# Altium project stove.PrjPcb
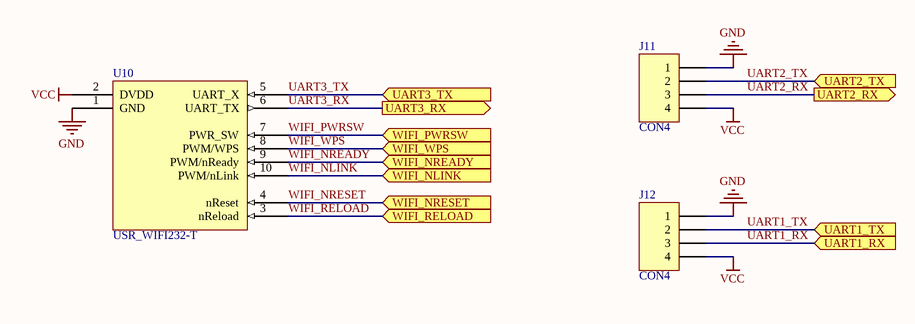
[diagram p0: misc.SchDoc]
6 sheets, 119 parts. Net scope: hierarchical (ports join the sheet entries above them; power ports are global).
Sheets:
  misc.SchDoc
  main.SchDoc
    U_sensor = sensor.SchDoc
    U_power = power.SchDoc
    U_relay_scr = relay_scr.SchDoc
    U_reset = reset.SchDoc

## Sheet misc.SchDoc
size A4

### Parts
J11  CON4  [HDR1X4]
J12  CON4  [HDR1X4]
U10  USR_WIFI232-T

### Ports
UART1_RX (in), UART1_TX (in), UART2_RX (out), UART2_TX (in), UART3_RX (out), UART3_TX (in), WIFI_NLINK (in), WIFI_NREADY (in), WIFI_NRESET (in), WIFI_PWRSW (in), WIFI_RELOAD (in), WIFI_WPS (in)

### Nets
GND: J11.1 J12.1 U10.1(GND)
VCC: J11.4 J12.4 U10.2(DVDD)
UART1_RX: J12.3 ; port UART1_RX
UART1_TX: J12.2 ; port UART1_TX
UART2_RX: J11.3 ; port UART2_RX
UART2_TX: J11.2 ; port UART2_TX
UART3_RX: U10.6(UART_TX) ; port UART3_RX
UART3_TX: U10.5(UART_X) ; port UART3_TX
WIFI_NLINK: U10.10(PWM/nLink) ; port WIFI_NLINK
WIFI_NREADY: U10.9(PWM/nReady) ; port WIFI_NREADY
WIFI_NRESET: U10.4(nReset) ; port WIFI_NRESET
WIFI_PWRSW: U10.7(PWR_SW) ; port WIFI_PWRSW
WIFI_RELOAD: U10.3(nReload) ; port WIFI_RELOAD
WIFI_WPS: U10.8(PWM/WPS) ; port WIFI_WPS

### Library data of the parts
J11 J12 = Header 4: Header, 4-Pin; LatestRevisionDate: 17-Jul-2002; LatestRevisionNote: Re-released for DXP Platform.; Publisher: Altium Limited

## Sheet main.SchDoc
size A4
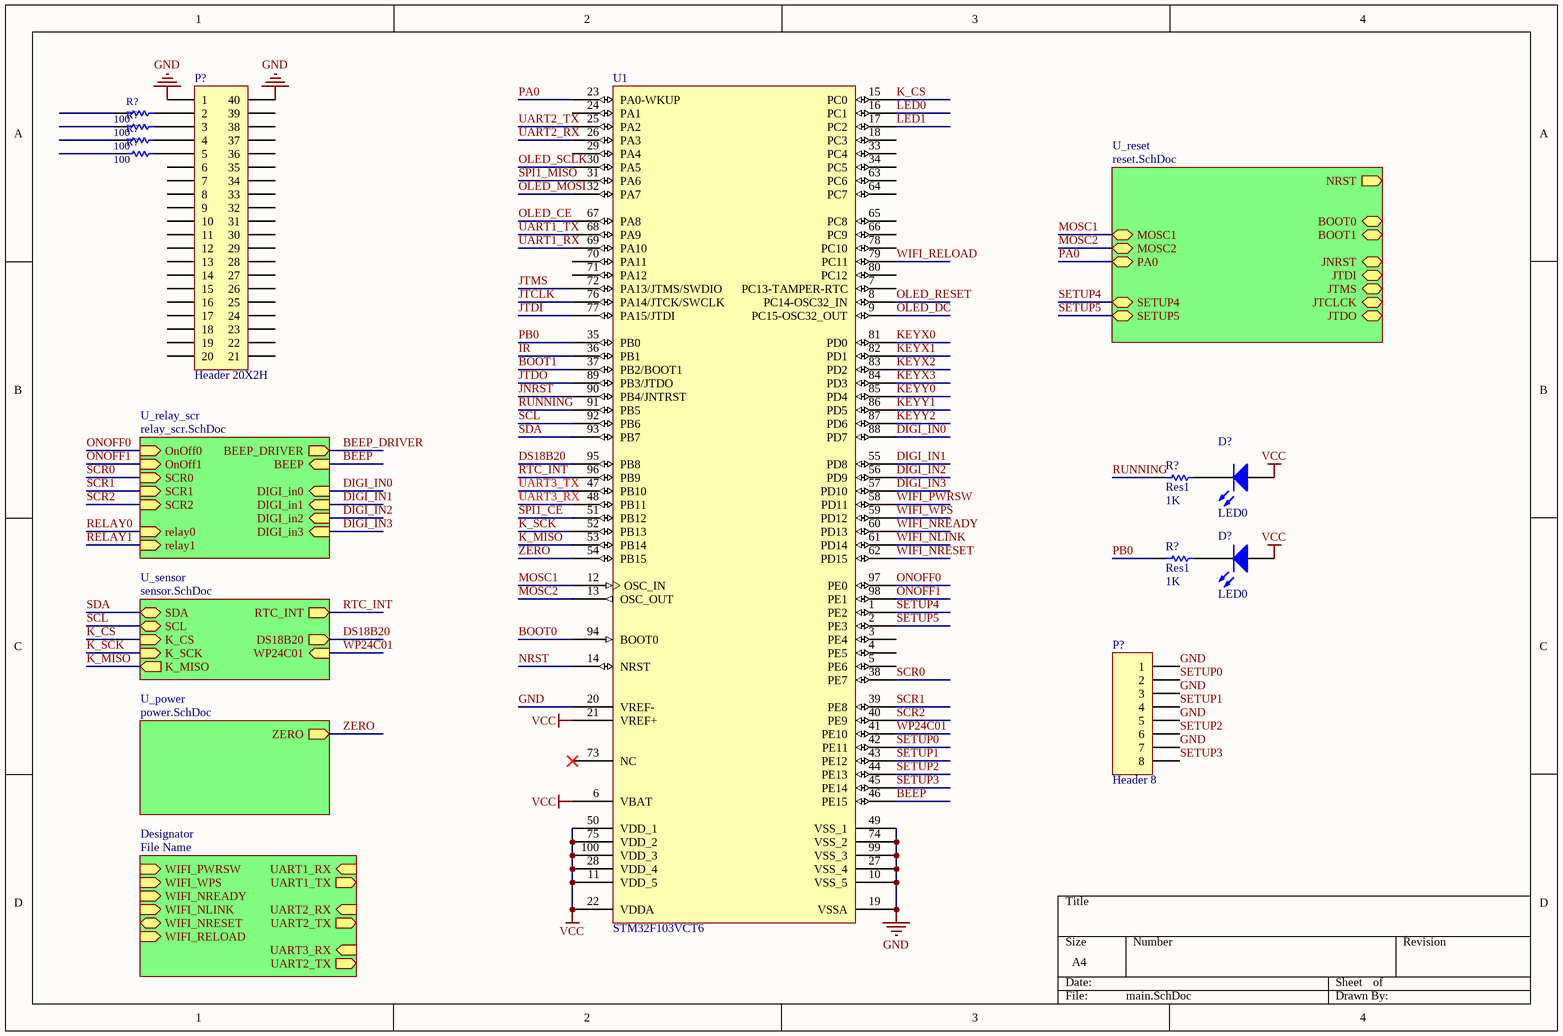
[diagram p1: main.SchDoc]

### Parts
(Parts that share a designator on the sheet are numbered #1, #2 ... from top to bottom, then left to right.)
D?#1  LED0  [LED-0]
D?#2  LED0  [LED-0]
P?#1  Header 20X2H  [HDR2X20H]
P?#2  Header 8  [HDR1X8]
R?#1  value 100  [AXIAL-0.3]  (hidden comment: Res1)
R?#2  value 100  [AXIAL-0.3]  (hidden comment: Res1)
R?#3  value 100  [AXIAL-0.3]  (hidden comment: Res1)
R?#4  value 100  [AXIAL-0.3]  (hidden comment: Res1)
R?#5  Res1  value 1K  [AXIAL-0.3]
R?#6  Res1  value 1K  [AXIAL-0.3]
U1  STM32F103VCT6  [LQFP100_N]

### Sub-sheets
Designator = File Name (file not in this document): WIFI_PWRSW (in), WIFI_WPS (in), WIFI_NREADY (in), WIFI_NLINK (in), WIFI_NRESET, WIFI_RELOAD (in), UART1_RX (in), UART1_TX (out), UART2_RX (in), UART2_TX (out), UART3_RX (in), UART2_TX (out)
U_power = power.SchDoc: ZERO (out)
U_relay_scr = relay_scr.SchDoc: OnOff0 (in), OnOff1 (in), SCR0 (in), SCR1 (in), SCR2 (in), relay0 (in), relay1 (in), BEEP_DRIVER (out), BEEP (in), DIGI_in0 (in), DIGI_in1 (in), DIGI_in2 (in), DIGI_in3 (in)
U_reset = reset.SchDoc: NRST (out), BOOT0, BOOT1, JNRST, JTDI, JTMS, JTCLCK, JTDO, MOSC1, MOSC2, PA0, SETUP4, SETUP5
U_sensor = sensor.SchDoc: SDA, SCL, K_CS (in), K_SCK (in), K_MISO (out), RTC_INT (out), DS18B20 (out), WP24C01 (in)

### Nets
GND: P?#1.1 P?#1.40 P?#2.1 P?#2.3 P?#2.5 P?#2.7 U1.10(VSS_5) U1.19(VSSA) U1.20(VREF-) U1.27(VSS_4) U1.49(VSS_1) U1.74(VSS_2) U1.99(VSS_3)
VCC: D?#1.1(A) D?#2.1(A) U1.6(VBAT) U1.11(VDD_5) U1.21(VREF+) U1.22(VDDA) U1.28(VDD_4) U1.50(VDD_1) U1.75(VDD_2) U1.100(VDD_3)
BEEP: U1.46(PE15) ; sheet U_relay_scr/BEEP
BOOT0: U1.94(BOOT0)
BOOT1: U1.37(PB2/BOOT1)
DIGI_IN0: U1.88(PD7) ; sheet U_relay_scr/DIGI_in0
DIGI_IN1: U1.55(PD8) ; sheet U_relay_scr/DIGI_in1
DIGI_IN2: U1.56(PD9) ; sheet U_relay_scr/DIGI_in2
DIGI_IN3: U1.57(PD10) ; sheet U_relay_scr/DIGI_in3
DS18B20: U1.95(PB8) ; sheet U_sensor/DS18B20
IR: U1.36(PB1)
JNRST: U1.90(PB4/JNTRST)
JTCLK: U1.76(PA14/JTCK/SWCLK)
JTDI: U1.77(PA15/JTDI)
JTDO: U1.89(PB3/JTDO)
JTMS: U1.72(PA13/JTMS/SWDIO)
K_CS: U1.15(PC0) ; sheet U_sensor/K_CS
K_MISO: U1.53(PB14) ; sheet U_sensor/K_MISO
K_SCK: U1.52(PB13) ; sheet U_sensor/K_SCK
KEYX0: U1.81(PD0)
KEYX1: U1.82(PD1)
KEYX2: U1.83(PD2)
KEYX3: U1.84(PD3)
KEYY0: U1.85(PD4)
KEYY1: U1.86(PD5)
KEYY2: U1.87(PD6)
LED0: U1.16(PC1)
LED1: U1.17(PC2)
MOSC1: U1.12(OSC_IN) ; sheet U_reset/MOSC1
MOSC2: U1.13(OSC_OUT) ; sheet U_reset/MOSC2
NRST: U1.14(NRST)
OLED_CE: U1.67(PA8)
OLED_DC: U1.9(PC15-OSC32_OUT)
OLED_MOSI: U1.32(PA7)
OLED_RESET: U1.8(PC14-OSC32_IN)
OLED_SCLK: U1.30(PA5)
ONOFF0: U1.97(PE0) ; sheet U_relay_scr/OnOff0
ONOFF1: U1.98(PE1) ; sheet U_relay_scr/OnOff1
PA0: U1.23(PA0-WKUP) ; sheet U_reset/PA0
PB0: R?#6.1 U1.35(PB0)
RTC_INT: U1.96(PB9) ; sheet U_sensor/RTC_INT
RUNNING: R?#5.1 U1.91(PB5)
SCL: U1.92(PB6) ; sheet U_sensor/SCL
SCR0: U1.38(PE7) ; sheet U_relay_scr/SCR0
SCR1: U1.39(PE8) ; sheet U_relay_scr/SCR1
SCR2: U1.40(PE9) ; sheet U_relay_scr/SCR2
SDA: U1.93(PB7) ; sheet U_sensor/SDA
SETUP0: P?#2.2 U1.42(PE11)
SETUP1: P?#2.4 U1.43(PE12)
SETUP2: P?#2.6 U1.44(PE13)
SETUP3: P?#2.8 U1.45(PE14)
SETUP4: U1.1(PE2) ; sheet U_reset/SETUP4
SETUP5: U1.2(PE3) ; sheet U_reset/SETUP5
SPI1_CE: U1.51(PB12)
SPI1_MISO: U1.31(PA6)
UART1_RX: U1.69(PA10)
UART1_TX: U1.68(PA9)
UART2_RX: U1.26(PA3)
UART2_TX: U1.25(PA2)
UART3_RX: U1.48(PB11)
UART3_TX: U1.47(PB10)
WIFI_NLINK: U1.61(PD14)
WIFI_NREADY: U1.60(PD13)
WIFI_NRESET: U1.62(PD15)
WIFI_PWRSW: U1.58(PD11)
WIFI_RELOAD: U1.79(PC11)
WIFI_WPS: U1.59(PD12)
WP24C01: U1.41(PE10) ; sheet U_sensor/WP24C01
ZERO: U1.54(PB15) ; sheet U_power/ZERO
NetD?#1_2: D?#1.2(K) R?#5.2
NetD?#2_2: D?#2.2(K) R?#6.2
NetP?#1_2: P?#1.2 R?#1.2
NetP?#1_3: P?#1.3 R?#2.2
NetP?#1_4: P?#1.4 R?#3.2
NetP?#1_5: P?#1.5 R?#4.2

Not connected (* = marked no-connect by the designer): P?#1 6 7 8 9 10 11 12 13 14 15 16 17 18 19 20 21 22 23 24 25 26 27 28 29 30 31 32 33 34 35 36 37 38 39; R?#1 1; R?#2 1; R?#3 1; R?#4 1; U1 3(PE4) 4(PE5) 5(PE6) 7(PC13-TAMPER-RTC) 18(PC3) 24(PA1) 29(PA4) 33(PC4) 34(PC5) 63(PC6) 64(PC7) 65(PC8) 66(PC9) 70(PA11) 71(PA12) 73(NC)* 78(PC10) 80(PC12)

### Library data of the parts
D?#1 D?#2 = LED0: Typical INFRARED GaAs LED; Published: 8-Jun-2000; LatestRevisionDate: 08-Jul-2005; LatestRevisionNote: Mech Layer 1 removed.; PackageReference: LED-0; Publisher: Altium Limited; PackageDescription: LED; 2 Leads
P?#1 = Header 20X2H: Header, 20-Pin, Dual row, Right Angle; LatestRevisionDate: 17-Jul-2002; LatestRevisionNote: Re-released for DXP Platform.; Publisher: Altium Limited
P?#2 = Header 8: Header, 8-Pin; LatestRevisionDate: 17-Jul-2002; LatestRevisionNote: Re-released for DXP Platform.; Publisher: Altium Limited
R?#1-R?#6 = Res1: Resistor; Published: 8-Jun-2000; LatestRevisionDate: 17-Jul-2002; LatestRevisionNote: Re-released for DXP Platform.; PackageReference: AXIAL-0.3; Publisher: Altium Limited; PackageDescription: Axial Device, Thru-Hole; 2 Leads; 0.3 in Pin Spacing
U1 = STM32F103VBT6: STM32 ARM-based 32-bit MCU with 64 Kbytes Flash, 100-pin LQFP, Industrial Temperature; Published: 30-May-2008; DatasheetVersion: rev6, Mar-2008; PackageVersion: Mar-2008; PackageReference: LQFP100; Publisher: Altium Limited; PackageDescription: 100-Pin Low-Profile Quad Flat Pack, 14 x 14 mm Body, 0.5 mm Pitch (LQFP100); ComponentLink1Description: Manufacturer Link; ComponentLink1URL: www.st.com/stm32; ComponentLink2Description: Datasheet; ComponentLink2URL: http://www.st.com/stonline/products/literature/ds/13587.pdf

## Sheet sensor.SchDoc
size A4
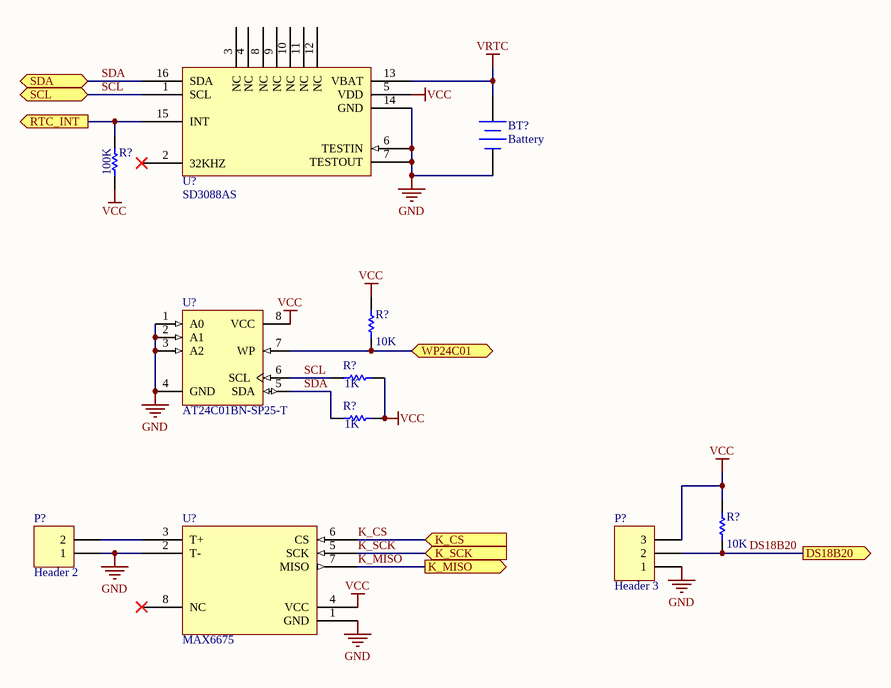
[diagram p2: sensor.SchDoc]

### Parts
(Parts that share a designator on the sheet are numbered #1, #2 ... from top to bottom, then left to right.)
BT?  Battery  [BAT-2]
P?#3  Header 2  [HDR1X2]
P?#4  Header 3  [HDR1X3]
R?#7  value 100K  [AXIAL-0.3]  (hidden comment: Res1)
R?#8  value 10K  [AXIAL-0.3]  (hidden comment: Res1)
R?#9  value 1K  [AXIAL-0.3]  (hidden comment: Res1)
R?#10  value 1K  [AXIAL-0.3]  (hidden comment: Res1)
R?#11  value 10K  [AXIAL-0.3]  (hidden comment: Res1)
U?#1  SD3088AS
U?#2  AT24C01BN-SP25-T  [8S1_N]
U?#3  MAX6675

### Ports
DS18B20 (out), K_CS (in), K_MISO (out), K_SCK (in), RTC_INT (out), SCL (bidir), SDA (bidir), WP24C01

### Nets
GND: BT?.2(-) P?#3.1 P?#4.1 U?#1.6(TESTIN) U?#1.7(TESTOUT) U?#1.14(GND) U?#2.1(A0) U?#2.2(A1) U?#2.3(A2) U?#2.4(GND) U?#3.1(GND) U?#3.2(T-)
VCC: P?#4.3 R?#7.1 R?#8.2 R?#9.2 R?#10.2 R?#11.2 U?#1.5(VDD) U?#2.8(VCC) U?#3.4(VCC)
VRTC: BT?.1(+) U?#1.13(VBAT)
DS18B20: P?#4.2 R?#11.1 ; port DS18B20
K_CS: U?#3.6(CS) ; port K_CS
K_MISO: U?#3.7(MISO) ; port K_MISO
K_SCK: U?#3.5(SCK) ; port K_SCK
RTC_INT: R?#7.2 U?#1.15(INT) ; port RTC_INT
SCL: R?#9.1 U?#1.1(SCL) U?#2.6(SCL) ; port SCL
SDA: R?#10.1 U?#1.16(SDA) U?#2.5(SDA) ; port SDA
WP24C01: R?#8.1 U?#2.7(WP) ; port WP24C01
NetP?#3_2: P?#3.2 U?#3.3(T+)

Not connected (* = marked no-connect by the designer): U?#1 2(32KHZ)* 3(NC) 4(NC) 8(NC) 9(NC) 10(NC) 11(NC) 12(NC); U?#3 8(NC)*

### Library data of the parts
BT? = Battery: Multicell Battery; Published: 24-Mar-1999; LatestRevisionDate: 17-Jul-2002; LatestRevisionNote: Re-released for DXP Platform.; PackageReference: BAT-2; Publisher: Altium Limited; PackageDescription: Battery; 2 Leads
P?#3 = Header 2: Header, 2-Pin; LatestRevisionDate: 17-Jul-2002; LatestRevisionNote: Re-released for DXP Platform.; Publisher: Altium Limited
P?#4 = Header 3: Header, 3-Pin; LatestRevisionDate: 17-Jul-2002; LatestRevisionNote: Re-released for DXP Platform.; Publisher: Altium Limited
R?#7-R?#11 = Res1: Resistor; Published: 8-Jun-2000; LatestRevisionDate: 17-Jul-2002; LatestRevisionNote: Re-released for DXP Platform.; PackageReference: AXIAL-0.3; Publisher: Altium Limited; PackageDescription: Axial Device, Thru-Hole; 2 Leads; 0.3 in Pin Spacing
U?#2 = AT24C01BN-SP25-T: 1Kbit (128 x 8), 2-wire Bus Automotive Serial EEPROM with Write Protect, 2.5V, 8-Pin SOIC, Tape & Reel; Published: 20-Sep-2010; DatasheetVersion: 8517C,  Jan-2009; PackageVersion: revC, Mar-2005; PackageReference: 8S1; Publisher: Altium Limited; PackageDescription: 8-Lead (0.150" Wide Body), Plastic Gull Wing Small Outline (JEDEC SOIC); Code_JEDEC: MS-012-AA; Code_IPC: SOIC127P600-8; ComponentLink1Description: Manufacturer Link; ComponentLink1URL: http://www.atmel.com/products/serial/default.asp; ComponentLink2Description: Datasheet; ComponentLink2URL: http://www.atmel.com/dyn/resources/prod_documents/doc8517.pdf; ComponentLink3Description: Atmel.com Home; ComponentLink3URL: http://www.atmel.com

## Sheet power.SchDoc
size A4
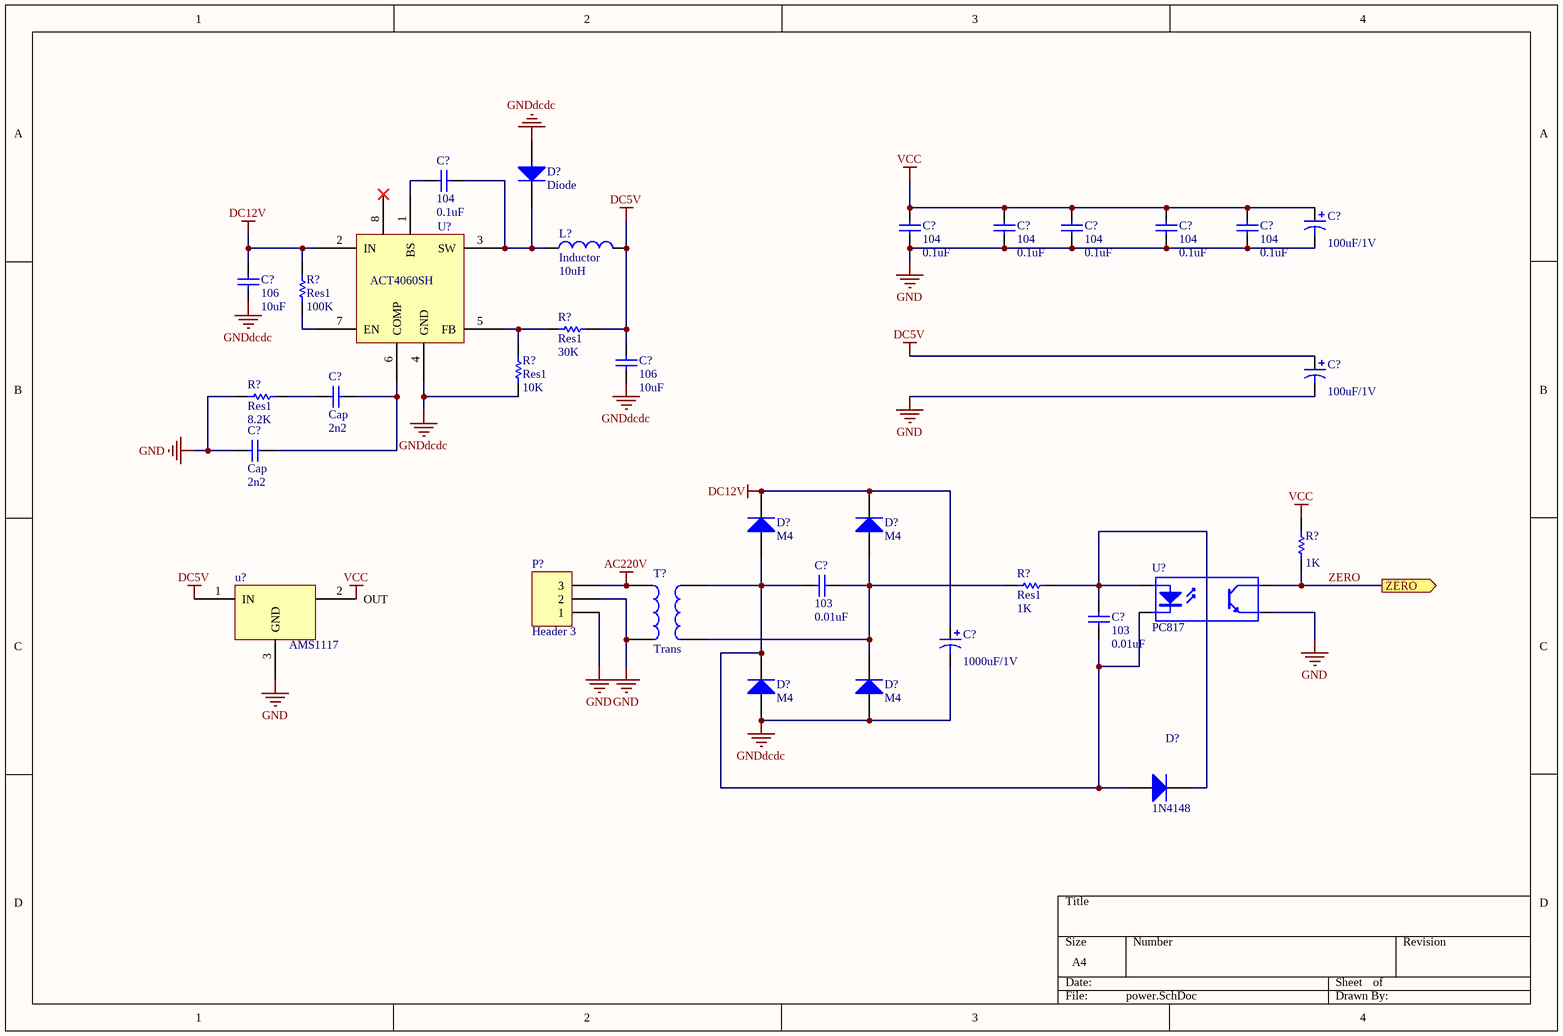
[diagram p3: power.SchDoc]

### Parts
(Parts that share a designator on the sheet are numbered #1, #2 ... from top to bottom, then left to right.)
C?#1  104  value 0.1uF  [RAD-0.3]
C?#2  value 100uF/1V  [RB7.6-15]  (hidden comment: Cap Pol1)
C?#3  104  value 0.1uF  [RAD-0.3]
C?#4  104  value 0.1uF  [RAD-0.3]
C?#5  104  value 0.1uF  [RAD-0.3]
C?#6  104  value 0.1uF  [RAD-0.3]
C?#7  104  value 0.1uF  [RAD-0.3]
C?#8  106  value 10uF  [RAD-0.3]
C?#9  106  value 10uF  [RAD-0.3]
C?#10  value 100uF/1V  [RB7.6-15]  (hidden comment: Cap Pol1)
C?#11  Cap  value 2n2  [RAD-0.3]
C?#12  Cap  value 2n2  [RAD-0.3]
C?#13  103  value 0.01uF  [RAD-0.3]
C?#14  103  value 0.01uF  [RAD-0.3]
C?#15  value 1000uF/1V  [RB7.6-15]  (hidden comment: Cap Pol1)
D?#3  Diode  [SMC]
D?#4  M4  [SMC]
D?#5  M4  [SMC]
D?#6  M4  [SMC]
D?#7  M4  [SMC]
D?#8  1N4148  [DO-35]
L?  Inductor  value 10uH  [0402-A]
P?#5  Header 3  [HDR1X3]
R?#12  Res1  value 100K  [AXIAL-0.3]
R?#13  Res1  value 30K  [AXIAL-0.3]
R?#14  Res1  value 8.2K  [AXIAL-0.3]
R?#15  Res1  value 10K  [AXIAL-0.3]
R?#16  value 1K  [AXIAL-0.3]  (hidden comment: Res1)
R?#17  Res1  value 1K  [AXIAL-0.3]
T?  Trans  [TRANS]
U?#4  ACT4060SH
U?#5  PC817  [DIP-4]
u?#6  AMS1117

### Ports
ZERO (out)

### Nets
AC220V: P?#5.3 T?.1
DC5V: C?#9.1 C?#10.1 L?.2 R?#13.2 u?#6.1(IN)
DC12V: C?#8.2 C?#15.1 D?#4.2(K) D?#5.2(K) R?#12.2 U?#4.2(IN)
GND: C?#2.2 C?#3.1 C?#4.1 C?#5.1 C?#6.1 C?#7.1 C?#10.2 C?#12.1 P?#5.1 P?#5.2 R?#14.1 T?.2 U?#5.3(E) u?#6.3(GND)
GNDdcdc: C?#8.1 C?#9.2 C?#15.2 D?#3.1(A) D?#6.1(A) D?#7.1(A) R?#15.1 U?#4.4(GND)
VCC: C?#2.1 C?#3.2 C?#4.2 C?#5.2 C?#6.2 C?#7.2 R?#16.2
ZERO: R?#16.1 U?#5.4(C) ; port ZERO
NetC?#1_1: C?#1.1 U?#4.1(BS)
NetC?#1_2: C?#1.2 D?#3.2(K) L?.1 U?#4.3(SW)
NetC?#11_1: C?#11.1 C?#12.2 U?#4.6(COMP)
NetC?#11_2: C?#11.2 R?#14.2
NetC?#13_1: C?#13.1 C?#14.1 D?#4.1(A) D?#6.2(K) D?#8.1(A) T?.3 U?#5.2(K)
NetC?#13_2: C?#13.2 D?#5.1(A) D?#7.2(K) R?#17.1 T?.4
NetC?#14_2: C?#14.2 D?#8.2(K) R?#17.2 U?#5.1(A)
NetR?#12_1: R?#12.1 U?#4.7(EN)
NetR?#13_1: R?#13.1 R?#15.2 U?#4.5(FB)

Not connected (* = marked no-connect by the designer): U?#4 8*; u?#6 2(OUT)

### Notes on the sheet
- Labels drawn without touching a wire or pin: VCC

### Library data of the parts
C?#1 C?#3-C?#9 C?#11-C?#14 = Cap: Capacitor; Published: 8-Jun-2000; LatestRevisionDate: 17-Jul-2002; LatestRevisionNote: Re-released for DXP Platform.; PackageReference: RAD-0.3; Publisher: Altium Limited; PackageDescription: Radial Cap, Thru-Hole; 2 Leads; 0.3 in Pin Spacing
C?#2 C?#10 C?#15 = Cap Pol1: Polarized Capacitor (Radial); Published: 8-Jun-2000; LatestRevisionDate: 17-Jul-2002; LatestRevisionNote: Re-released for DXP Platform.; PackageReference: RB7.6-15; Publisher: Altium Limited; PackageDescription: Polarized Capacitor (Radial); 2 Leads
D?#3-D?#7 = Diode: Default Diode; Published: 8-Jun-2000; LatestRevisionDate: 17-Jul-2002; LatestRevisionNote: Re-released for DXP Platform.; PackageVersion: Sep-1996; PackageReference: SMC; Publisher: Altium Limited; PackageDescription: DO-214-AB/SMC; 2 C-Bend Leads; Body 7.9 x 5.9 mm, inc. leads (LxW); Code_JEDEC: DO-214-AB
D?#8 = Diode 1N4148: High Conductance Fast Diode; Published: 8-Jun-2000; LatestRevisionDate: 17-Jul-2002; LatestRevisionNote: Re-released for DXP Platform.; DatasheetVersion: 1997; PackageReference: DO-35; Publisher: Altium Limited; PackageDescription: Diode, Axial; Body 3.8 x 1.9 mm (LxDia. max), Lead Dia. 0.53 mm (max); Code_JEDEC: DO-204-AH; ComponentLink1Description: Manufacturer Link; ComponentLink1URL: http://www.fairchildsemi.com/; ComponentLink2Description: Datasheet; ComponentLink2URL: http://www.fairchildsemi.com/ds/1N%2F1N4148.pdf
L? = Inductor: Code_IEC: 1005; Published: 8-Jun-2000; LatestRevisionDate: 29-May-2009; LatestRevisionNote: IPC-7351 Footprint Added.; PackageReference: 0402-A; Publisher: Altium Limited; PackageDescription: Chip Inductor; Code_JEITA: 0402
P?#5 = Header 3: Header, 3-Pin; LatestRevisionDate: 17-Jul-2002; LatestRevisionNote: Re-released for DXP Platform.; Publisher: Altium Limited
R?#12-R?#17 = Res1: Resistor; Published: 8-Jun-2000; LatestRevisionDate: 17-Jul-2002; LatestRevisionNote: Re-released for DXP Platform.; PackageReference: AXIAL-0.3; Publisher: Altium Limited; PackageDescription: Axial Device, Thru-Hole; 2 Leads; 0.3 in Pin Spacing
T? = Trans: Transformer; Published: 24-Mar-1999; LatestRevisionDate: 08-Jul-2005; LatestRevisionNote: Mech Layer 1 removed.; PackageReference: TRANS; Publisher: Altium Limited; PackageDescription: Transformer; 4 Leads
U?#5 = Optoisolator1: 4-Pin Phototransistor Optocoupler; Published: 24-Mar-1999; LatestRevisionDate: 04-Mar-2005; LatestRevisionNote: Sch pins 3 & 4 Swapped.; DatasheetVersion: Nov-2003; PackageReference: DIP-4; Publisher: Altium Limited

## Sheet relay_scr.SchDoc
size A4
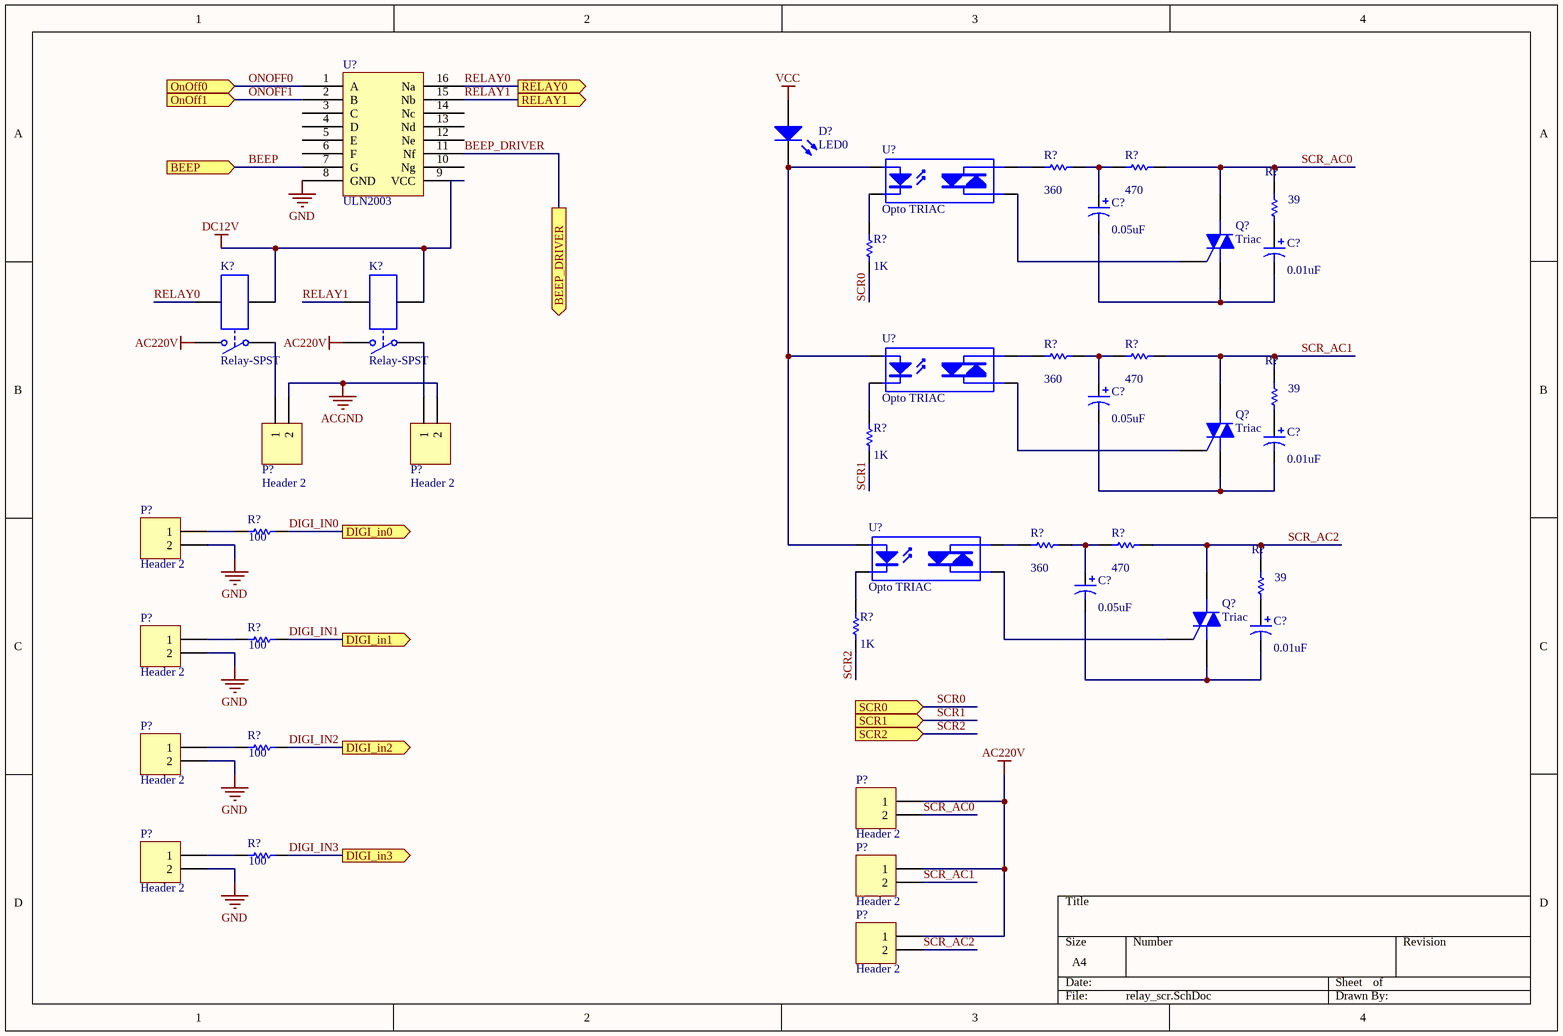
[diagram p4: relay_scr.SchDoc]

### Parts
(Parts that share a designator on the sheet are numbered #1, #2 ... from top to bottom, then left to right.)
C?#16  value 0.05uF  [RB7.6-15]  (hidden comment: Cap Pol1)
C?#17  value 0.01uF  [RB7.6-15]  (hidden comment: Cap Pol1)
C?#18  value 0.05uF  [RB7.6-15]  (hidden comment: Cap Pol1)
C?#19  value 0.01uF  [RB7.6-15]  (hidden comment: Cap Pol1)
C?#20  value 0.05uF  [RB7.6-15]  (hidden comment: Cap Pol1)
C?#21  value 0.01uF  [RB7.6-15]  (hidden comment: Cap Pol1)
D?#9  LED0  [LED-0]
K?#1  Relay-SPST  [MODULE4]
K?#2  Relay-SPST  [MODULE4]
P?#6  Header 2  [HDR1X2]
P?#7  Header 2  [HDR1X2]
P?#8  Header 2  [HDR1X2]
P?#9  Header 2  [HDR1X2]
P?#10  Header 2  [HDR1X2]
P?#11  Header 2  [HDR1X2]
P?#12  Header 2  [HDR1X2]
P?#13  Header 2  [HDR1X2]
P?#14  Header 2  [HDR1X2]
Q?#1  Triac  [369-03]
Q?#2  Triac  [369-03]
Q?#3  Triac  [369-03]
R?#18  value 360  [AXIAL-0.3]  (hidden comment: Res1)
R?#19  value 470  [AXIAL-0.3]  (hidden comment: Res1)
R?#20  value 39  [AXIAL-0.3]  (hidden comment: Res1)
R?#21  value 1K  [AXIAL-0.3]  (hidden comment: Res1)
R?#22  value 360  [AXIAL-0.3]  (hidden comment: Res1)
R?#23  value 470  [AXIAL-0.3]  (hidden comment: Res1)
R?#24  value 39  [AXIAL-0.3]  (hidden comment: Res1)
R?#25  value 1K  [AXIAL-0.3]  (hidden comment: Res1)
R?#26  value 100  [AXIAL-0.3]  (hidden comment: Res1)
R?#27  value 360  [AXIAL-0.3]  (hidden comment: Res1)
R?#28  value 470  [AXIAL-0.3]  (hidden comment: Res1)
R?#29  value 39  [AXIAL-0.3]  (hidden comment: Res1)
R?#30  value 100  [AXIAL-0.3]  (hidden comment: Res1)
R?#31  value 1K  [AXIAL-0.3]  (hidden comment: Res1)
R?#32  value 100  [AXIAL-0.3]  (hidden comment: Res1)
R?#33  value 100  [AXIAL-0.3]  (hidden comment: Res1)
U?#7  ULN2003
U?#8  Opto TRIAC  [NPSIP4A]
U?#9  Opto TRIAC  [NPSIP4A]
U?#10  Opto TRIAC  [NPSIP4A]

### Ports
BEEP (in), BEEP_DRIVER (out), DIGI_in0 (out), DIGI_in1 (out), DIGI_in2 (out), DIGI_in3 (out), OnOff0 (in), OnOff1 (in), RELAY0 (out), RELAY1 (out), SCR0 (in), SCR1 (in), SCR2 (in)

### Nets
AC220V: K?#1.2 K?#2.2 P?#11.1 P?#13.1 P?#14.1
ACGND: P?#6.2 P?#7.2
DC12V: K?#1.3 K?#2.3 U?#7.9(VCC)
GND: P?#8.2 P?#9.2 P?#10.2 P?#12.2 U?#7.8(GND)
VCC: D?#9.1(A)
BEEP: U?#7.7(G) ; port BEEP
BEEP_DRIVER: U?#7.11(Nf) ; port BEEP_DRIVER
DIGI_IN0: R?#26.2 ; port DIGI_in0
DIGI_IN1: R?#30.2 ; port DIGI_in1
DIGI_IN2: R?#32.2 ; port DIGI_in2
DIGI_IN3: R?#33.2 ; port DIGI_in3
ONOFF0: U?#7.1(A) ; port OnOff0
ONOFF1: U?#7.2(B) ; port OnOff1
RELAY0: K?#1.4 U?#7.16(Na) ; port RELAY0
RELAY1: K?#2.4 U?#7.15(Nb) ; port RELAY1
SCR0: R?#21.1 ; port SCR0
SCR1: R?#25.1 ; port SCR1
SCR2: R?#31.1 ; port SCR2
SCR_AC0: P?#11.2 Q?#1.2(M2) R?#19.1 R?#20.2
SCR_AC1: P?#13.2 Q?#2.2(M2) R?#23.1 R?#24.2
SCR_AC2: P?#14.2 Q?#3.2(M2) R?#28.1 R?#29.2
NetC?#16_1: C?#16.1 R?#18.1 R?#19.2
NetC?#16_2: C?#16.2 C?#17.2 Q?#1.1(M1)
NetC?#17_1: C?#17.1 R?#20.1
NetC?#18_1: C?#18.1 R?#22.1 R?#23.2
NetC?#18_2: C?#18.2 C?#19.2 Q?#2.1(M1)
NetC?#19_1: C?#19.1 R?#24.1
NetC?#20_1: C?#20.1 R?#27.1 R?#28.2
NetC?#20_2: C?#20.2 C?#21.2 Q?#3.1(M1)
NetC?#21_1: C?#21.1 R?#29.1
NetD?#9_2: D?#9.2(K) U?#8.1(A) U?#9.1(A) U?#10.1(A)
NetK?#1_1: K?#1.1 P?#6.1
NetK?#2_1: K?#2.1 P?#7.1
NetP?#8_1: P?#8.1 R?#26.1
NetP?#9_1: P?#9.1 R?#30.1
NetP?#10_1: P?#10.1 R?#32.1
NetP?#12_1: P?#12.1 R?#33.1
NetQ?#1_3: Q?#1.3(G) U?#8.4(A/K)
NetQ?#2_3: Q?#2.3(G) U?#9.4(A/K)
NetQ?#3_3: Q?#3.3(G) U?#10.4(A/K)
NetR?#18_2: R?#18.2 U?#8.3(A/K)
NetR?#21_2: R?#21.2 U?#8.2(K)
NetR?#22_2: R?#22.2 U?#9.3(A/K)
NetR?#25_2: R?#25.2 U?#9.2(K)
NetR?#27_2: R?#27.2 U?#10.3(A/K)
NetR?#31_2: R?#31.2 U?#10.2(K)

Not connected (* = marked no-connect by the designer): U?#7 3(C) 4(D) 5(E) 6(F) 10(Ng) 12(Ne) 13(Nd) 14(Nc)

### Library data of the parts
C?#16-C?#21 = Cap Pol1: Polarized Capacitor (Radial); Published: 8-Jun-2000; LatestRevisionDate: 17-Jul-2002; LatestRevisionNote: Re-released for DXP Platform.; PackageReference: RB7.6-15; Publisher: Altium Limited; PackageDescription: Polarized Capacitor (Radial); 2 Leads
D?#9 = LED0: Typical INFRARED GaAs LED; Published: 8-Jun-2000; LatestRevisionDate: 08-Jul-2005; LatestRevisionNote: Mech Layer 1 removed.; PackageReference: LED-0; Publisher: Altium Limited; PackageDescription: LED; 2 Leads
K?#1 K?#2 = Relay-SPST: Single-Pole Single-Throw Relay; Published: 24-Mar-1999; LatestRevisionDate: 17-Jul-2002; LatestRevisionNote: Re-released for DXP Platform.; PackageReference: MODULE4; Publisher: Altium Limited
P?#6-P?#14 = Header 2: Header, 2-Pin; LatestRevisionDate: 17-Jul-2002; LatestRevisionNote: Re-released for DXP Platform.; Publisher: Altium Limited
Q?#1-Q?#3 = Triac: Silicon Bidirectional Triode Thyristor; Note: Pin 2 is electrically connected to Pin 4 (TAB); Published: 29-Sep-2000; LatestRevisionDate: 17-Jul-2002; LatestRevisionNote: Re-released for DXP Platform.; DatasheetVersion: 1999; PackageReference: 369-03; Publisher: Altium Limited; PackageDescription: TO, Thru-Hole, Vertical, Heatsink Mounted; 3 In-Line Leads; Pitch 2.28 mm; ComponentLink1Description: Manufacturer Link; ComponentLink1URL: http://www.motorola.com/
R?#18-R?#33 = Res1: Resistor; Published: 8-Jun-2000; LatestRevisionDate: 17-Jul-2002; LatestRevisionNote: Re-released for DXP Platform.; PackageReference: AXIAL-0.3; Publisher: Altium Limited; PackageDescription: Axial Device, Thru-Hole; 2 Leads; 0.3 in Pin Spacing
U?#8-U?#10 = Opto TRIAC: Opto-Triac; Published: 24-Mar-1999; LatestRevisionDate: 17-Jul-2002; LatestRevisionNote: Re-released for DXP Platform.; PackageReference: NPSIP4A; Publisher: Altium Limited; PackageDescription: SIP; 4 Leads; Body 10 x 11.5 x 7.5 mm (typ); Pitch 2.54 mm

## Sheet reset.SchDoc
size A4
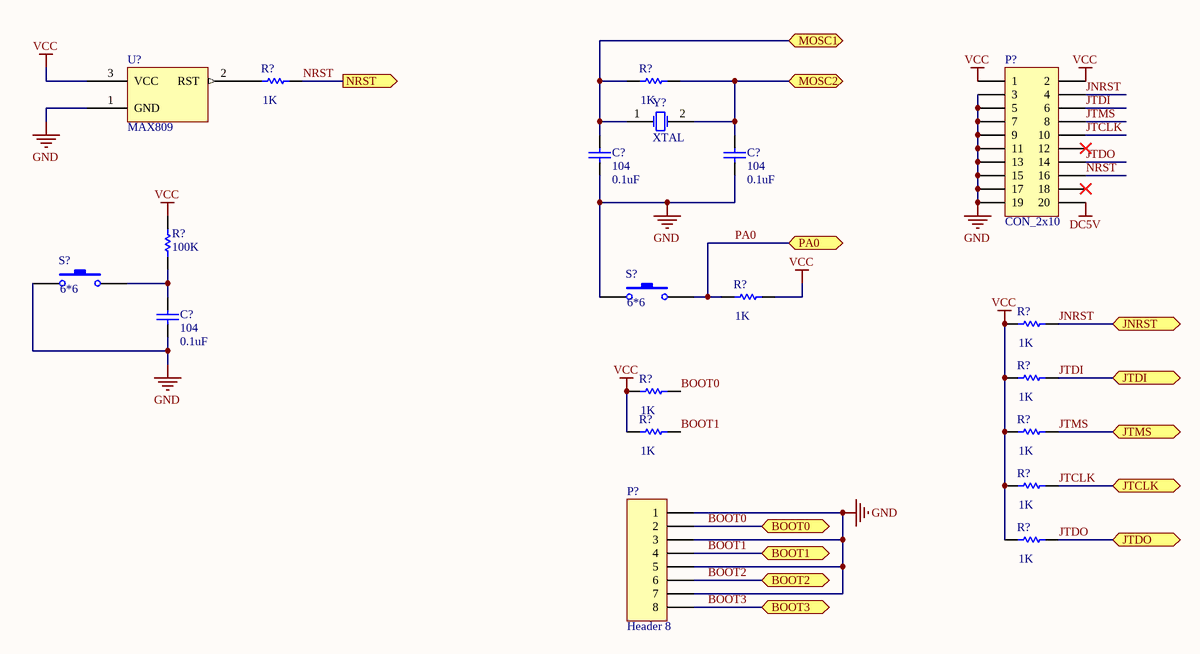
[diagram p5: reset.SchDoc]

### Parts
(Parts that share a designator on the sheet are numbered #1, #2 ... from top to bottom, then left to right.)
C?#22  104  value 0.1uF  [RAD-0.3]
C?#23  104  value 0.1uF  [RAD-0.3]
C?#24  104  value 0.1uF  [RAD-0.3]
P?#15  CON_2x10  [HDR2X10]
P?#16  Header 8  [HDR1X8]
R?#34  value 1K  [AXIAL-0.3]  (hidden comment: Res1)
R?#35  value 1K  [AXIAL-0.3]  (hidden comment: Res1)
R?#36  value 100K  [AXIAL-0.3]  (hidden comment: Res1)
R?#37  value 1K  [AXIAL-0.3]  (hidden comment: Res1)
R?#38  value 1K  [AXIAL-0.3]  (hidden comment: Res1)
R?#39  value 1K  [AXIAL-0.3]  (hidden comment: Res1)
R?#40  value 1K  [AXIAL-0.3]  (hidden comment: Res1)
R?#41  value 1K  [AXIAL-0.3]  (hidden comment: Res1)
R?#42  value 1K  [AXIAL-0.3]  (hidden comment: Res1)
R?#43  value 1K  [AXIAL-0.3]  (hidden comment: Res1)
R?#44  value 1K  [AXIAL-0.3]  (hidden comment: Res1)
S?#1  6*6  [SPST-2]
S?#2  6*6  [SPST-2]
U?#11  MAX809  [SOT-23]
Y?  XTAL  [R38]

### Ports
BOOT0 (bidir), BOOT1 (bidir), BOOT2 (bidir), BOOT3 (bidir), JNRST (bidir), JTCLK (bidir), JTDI (bidir), JTDO (bidir), JTMS (bidir), MOSC1 (bidir), MOSC2 (bidir), NRST (out), PA0 (bidir)

### Nets
DC5V: P?#15.20
GND: C?#22.1 C?#23.1 C?#24.1 P?#15.3 P?#15.5 P?#15.7 P?#15.9 P?#15.11 P?#15.13 P?#15.15 P?#15.17 P?#15.19 P?#16.1 P?#16.3 P?#16.5 P?#16.7 S?#1.1 S?#2.1 U?#11.1(GND)
VCC: P?#15.1 P?#15.2 R?#36.2 R?#37.2 R?#38.1 R?#39.1 R?#40.1 R?#41.1 R?#42.1 R?#43.1 R?#44.1 U?#11.3(VCC)
BOOT0: P?#16.2 R?#40.2 ; port BOOT0
BOOT1: P?#16.4 R?#41.2 ; port BOOT1
BOOT2: P?#16.6 ; port BOOT2
BOOT3: P?#16.8 ; port BOOT3
JNRST: P?#15.4 R?#38.2 ; port JNRST
JTCLK: P?#15.10 R?#43.2 ; port JTCLK
JTDI: P?#15.6 R?#39.2 ; port JTDI
JTDO: P?#15.14 R?#44.2 ; port JTDO
JTMS: P?#15.8 R?#42.2 ; port JTMS
MOSC1: C?#22.2 R?#35.1 Y?.1(OSC1) ; port MOSC1
MOSC2: C?#23.2 R?#35.2 Y?.2(OSC2) ; port MOSC2
NRST: P?#15.16 R?#34.2 ; port NRST
PA0: R?#37.1 S?#2.2 ; port PA0
NetC?#24_2: C?#24.2 R?#36.1 S?#1.2
NetR?#34_1: R?#34.1 U?#11.2(RST)

Not connected (* = marked no-connect by the designer): P?#15 12* 18*

### Library data of the parts
C?#22-C?#24 = Cap: Capacitor; Published: 8-Jun-2000; LatestRevisionDate: 17-Jul-2002; LatestRevisionNote: Re-released for DXP Platform.; PackageReference: RAD-0.3; Publisher: Altium Limited; PackageDescription: Radial Cap, Thru-Hole; 2 Leads; 0.3 in Pin Spacing
P?#15 = Header 10X2: Header, 10-Pin, Dual row; LatestRevisionDate: 17-Jul-2002; LatestRevisionNote: Re-released for DXP Platform.; Publisher: Altium Limited
P?#16 = Header 8: Header, 8-Pin; LatestRevisionDate: 17-Jul-2002; LatestRevisionNote: Re-released for DXP Platform.; Publisher: Altium Limited
R?#34-R?#44 = Res1: Resistor; Published: 8-Jun-2000; LatestRevisionDate: 17-Jul-2002; LatestRevisionNote: Re-released for DXP Platform.; PackageReference: AXIAL-0.3; Publisher: Altium Limited; PackageDescription: Axial Device, Thru-Hole; 2 Leads; 0.3 in Pin Spacing
S?#1 S?#2 = SW-PB: Switch; Published: 24-Mar-1999; LatestRevisionDate: 17-Jul-2002; LatestRevisionNote: Re-released for DXP Platform.; PackageReference: SPST-2; Publisher: Altium Limited; PackageDescription: Switch; 2 Leads
Y? = XTAL: Crystal Oscillator; Published: 8-Jun-2000; LatestRevisionDate: 17-Jul-2002; LatestRevisionNote: Re-released for DXP Platform.; PackageReference: R38; Publisher: Altium Limited; PackageDescription: Crystal, Thru-Hole; 2 Leads; Body 3.1 x 8.2 mm (Dia.xH)

## Nets that join several sheets
AC220V: power (P?#5.3 T?.1), relay_scr (5 pins)
DC5V: power (5 pins), reset (P?#15.20)
DC12V: power (6 pins), relay_scr (K?#1.3 K?#2.3 U?#7.9)
GND: misc (J11.1 J12.1 U10.1), main (13 pins), sensor (12 pins), power (14 pins), relay_scr (5 pins), reset (19 pins)
VCC: misc (J11.4 J12.4 U10.2), main (10 pins), sensor (9 pins), power (7 pins), relay_scr (D?#9.1), reset (12 pins)
BEEP: main (U1.46), relay_scr (U?#7.7)
DIGI_IN0: main (U1.88), relay_scr (R?#26.2)
DIGI_IN1: main (U1.55), relay_scr (R?#30.2)
DIGI_IN2: main (U1.56), relay_scr (R?#32.2)
DIGI_IN3: main (U1.57), relay_scr (R?#33.2)
DS18B20: main (U1.95), sensor (P?#4.2 R?#11.1)
K_CS: main (U1.15), sensor (U?#3.6)
K_MISO: main (U1.53), sensor (U?#3.7)
K_SCK: main (U1.52), sensor (U?#3.5)
MOSC1: main (U1.12), reset (C?#22.2 R?#35.1 Y?.1)
MOSC2: main (U1.13), reset (C?#23.2 R?#35.2 Y?.2)
ONOFF0: main (U1.97), relay_scr (U?#7.1)
ONOFF1: main (U1.98), relay_scr (U?#7.2)
PA0: main (U1.23), reset (R?#37.1 S?#2.2)
RTC_INT: main (U1.96), sensor (R?#7.2 U?#1.15)
SCL: main (U1.92), sensor (R?#9.1 U?#1.1 U?#2.6)
SCR0: main (U1.38), relay_scr (R?#21.1)
SCR1: main (U1.39), relay_scr (R?#25.1)
SCR2: main (U1.40), relay_scr (R?#31.1)
SDA: main (U1.93), sensor (R?#10.1 U?#1.16 U?#2.5)
WP24C01: main (U1.41), sensor (R?#8.1 U?#2.7)
ZERO: main (U1.54), power (R?#16.1 U?#5.4)